# Altium schematic sheet Driver.SchDoc
size 297 x 209 mm; ENG_APP_DATE: --/--/--; DSN_APP_DATE: --/--/--; CHK_APP_DATE: --/--/--; SheetNumber: 2; SheetTotal: 5
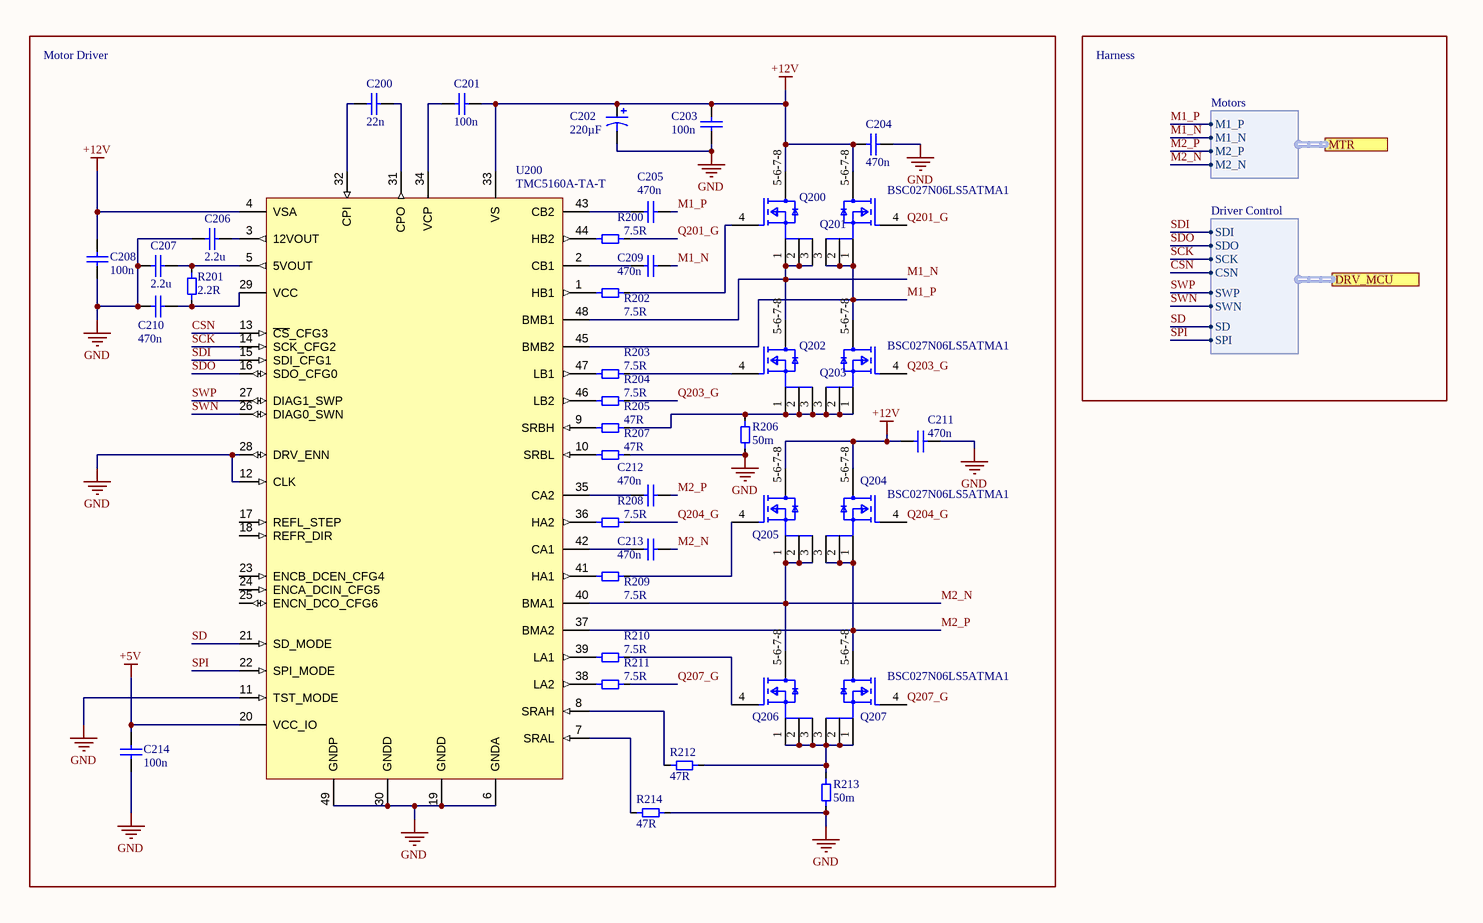
[diagram p0: Driver.SchDoc, right]

## Parts
C200  22n  [MLCC_0603_M]
C201  100n  [MLCC_0603_M]
C202  value 220µF  [8mm Cap]  (hidden comment: EEU-FS1H221L)
C203  100n  [MLCC_0603_M]
C204  470n  [MLCC_0805_M]
C205  470n  [MLCC_0805_M]
C206  2.2u  [MLCC_0805_M]
C207  2.2u  [MLCC_0805_M]
C208  100n  [MLCC_0603_M]
C209  470n  [MLCC_0805_M]
C210  470n  [MLCC_0805_M]
C211  470n  [MLCC_0805_M]
C212  470n  [MLCC_0805_M]
C213  470n  [MLCC_0805_M]
C214  100n  [MLCC_0603_M]
Q200  BSC027N06LS5ATMA1  [FP-PG-TDSON-8-MFG]  (value not drawn)
Q201  BSC027N06LS5ATMA1  [FP-PG-TDSON-8-MFG]
Q202  BSC027N06LS5ATMA1  [FP-PG-TDSON-8-MFG]  (value not drawn)
Q203  BSC027N06LS5ATMA1  [FP-PG-TDSON-8-MFG]
Q204  BSC027N06LS5ATMA1  [FP-PG-TDSON-8-MFG]
Q205  BSC027N06LS5ATMA1  [FP-PG-TDSON-8-MFG]  (value not drawn)
Q206  BSC027N06LS5ATMA1  [FP-PG-TDSON-8-MFG]  (value not drawn)
Q207  BSC027N06LS5ATMA1  [FP-PG-TDSON-8-MFG]
R200  7.5R  [Resistor_0603_M]
R201  2.2R  [Resistor_0603_M]
R202  7.5R  [Resistor_0603_M]
R203  7.5R  [Resistor_0603_M]
R204  7.5R  [Resistor_0603_M]
R205  47R  [Resistor_0603_M]
R206  value 50m  [PE0612FKM7W0R05L-Footprint-1]  (hidden comment: PE0612FKM7W0R05L)
R207  47R  [Resistor_0603_M]
R208  7.5R  [Resistor_0603_M]
R209  7.5R  [Resistor_0603_M]
R210  7.5R  [Resistor_0603_M]
R211  7.5R  [Resistor_0603_M]
R212  47R  [Resistor_0603_M]
R213  value 50m  [PE0612FKM7W0R05L-Footprint-1]  (hidden comment: PE0612FKM7W0R05L)
R214  47R  [Resistor_0603_M]
U200  TMC5160A-TA-T  [TQFP80P900X900X120-32N]

## Blocks framed on the sheet
Motor Driver: C200-C214 Q200-Q207 R200-R214 U200

## Ports
DRV_MCU (harness Driver Control, see Overview[3B], MCU_USB[2A]), MTR (harness Motors, see Overview[3B], Headers[2A])

## Harnesses
Motors: M1_P, M1_N, M2_P, M2_N
Driver Control: SCK, SWP, SWN, SDO, SD, SDI, SPI, CSN

## Nets
+5V: C214.2 U200.20(VCC_IO)
+12V: C201.1 C202.2 C203.2 C204.2 C208.2 C211.1 Q200.5-6-7-8(D) Q201.5-6-7-8(D) Q204.5-6-7-8(D) Q205.5-6-7-8(D) U200.4(VSA) U200.33(VS)
GND: C202.1 C203.1 C204.1 C206.1 C207.1 C208.1 C210.1 C211.2 C214.1 R206.1 R207.1 R213.1 R214.1 U200.6(GNDA) U200.11(TST_MODE) U200.12(CLK) U200.19(GNDD) U200.28(DRV_ENN) U200.30(GNDD) U200.49(GNDP)
CSN: U200.13(~{CS}_CFG3) ; port DRV_MCU.CSN
M1_N: C209.2 Q200.1(S) Q200.2(S) Q200.3(S) Q202.5-6-7-8(D) U200.48(BMB1) ; port MTR.M1_N
M1_P: C205.2 Q201.1(S) Q201.2(S) Q201.3(S) Q203.5-6-7-8(D) U200.45(BMB2) ; port MTR.M1_P
M2_N: C213.2 Q205.1(S) Q205.2(S) Q205.3(S) Q206.5-6-7-8(D) U200.40(BMA1) ; port MTR.M2_N
M2_P: C212.2 Q204.1(S) Q204.2(S) Q204.3(S) Q207.5-6-7-8(D) U200.37(BMA2) ; port MTR.M2_P
Q201_G: Q201.4(G) R200.2
Q203_G: Q203.4(G) R204.2
Q204_G: Q204.4(G) R208.2
Q207_G: Q207.4(G) R211.2
SCK: U200.14(SCK_CFG2) ; port DRV_MCU.SCK
SD: U200.21(SD_MODE) ; port DRV_MCU.SD
SDI: U200.15(SDI_CFG1) ; port DRV_MCU.SDI
SDO: U200.16(SDO_CFG0) ; port DRV_MCU.SDO
SPI: U200.22(SPI_MODE) ; port DRV_MCU.SPI
SWN: U200.26(DIAG0_SWN) ; port DRV_MCU.SWN
SWP: U200.27(DIAG1_SWP) ; port DRV_MCU.SWP
NetC200_1: C200.1 U200.32(CPI)
NetC200_2: C200.2 U200.31(CPO)
NetC201_2: C201.2 U200.34(VCP)
NetC205_1: C205.1 U200.43(CB2)
NetC206_2: C206.2 U200.3(12VOUT)
NetC207_2: C207.2 R201.2 U200.5(5VOUT)
NetC209_1: C209.1 U200.2(CB1)
NetC210_2: C210.2 R201.1 U200.29(VCC)
NetC212_1: C212.1 U200.35(CA2)
NetC213_1: C213.1 U200.42(CA1)
NetQ200_4: Q200.4(G) R202.2
NetQ202_1: Q202.1(S) Q202.2(S) Q202.3(S) Q203.1(S) Q203.2(S) Q203.3(S) R205.1 R206.2
NetQ202_4: Q202.4(G) R203.2
NetQ205_4: Q205.4(G) R209.2
NetQ206_1: Q206.1(S) Q206.2(S) Q206.3(S) Q207.1(S) Q207.2(S) Q207.3(S) R212.1 R213.2
NetQ206_4: Q206.4(G) R210.2
NetR200_1: R200.1 U200.44(HB2)
NetR202_1: R202.1 U200.1(HB1)
NetR203_1: R203.1 U200.47(LB1)
NetR204_1: R204.1 U200.46(LB2)
NetR205_2: R205.2 U200.9(SRBH)
NetR207_2: R207.2 U200.10(SRBL)
NetR208_1: R208.1 U200.36(HA2)
NetR209_1: R209.1 U200.41(HA1)
NetR210_1: R210.1 U200.39(LA1)
NetR211_1: R211.1 U200.38(LA2)
NetR212_2: R212.2 U200.8(SRAH)
NetR214_2: R214.2 U200.7(SRAL)

Not connected (* = marked no-connect by the designer): U200 17(REFL_STEP) 18(REFR_DIR) 23(ENCB_DCEN_CFG4) 24(ENCA_DCIN_CFG5) 25(ENCN_DCO_CFG6)

## Notes on the sheet
- Harness
- THIS DOCUMENT AND THE DATA DISCLOSED HEREIN OR
- HEREWITH IS THE PROPERTY OF ALTIUM LIMITED AND MAY
- DWG NO:
- REVISION
- REV:
- DESCRIPTION
- DATE
- APPROVED
- BE FREELY DISTRIBUTED IN WHOLE. NO RIGHTS ARE
- RESERVED OR EXPRESS OR IMPLIED WARANTEE GIVEN.
- ENG:
- APPROVALS
- PROJECT
- DSN:
- CHK:
- REFERENCE DOCUMENTS
- PROJECT REVISION:
- TITLE
- DOCUMENT REVISION:
- DESIGN ITEM:
- BOM:
- FAB DWG:
- PCB DWG:
- ASSY DWG:
- SCALE:
- A3
- SIZE
- CAGE CODE
- FILE NAME
- DWG NO.
- SHEET
- OF
- REV

## Library data of the parts
C200 = CMP-001-0577-1: MLCC, 0603, 22n, 10%, 6.3V, X7R; Manufacturer: Any; Value: 22nF; Capacitor Type: Ceramic; Voltage: 6,3V; Mount: SMD; RoHS: Yes; Tolerance: 10%; Dielectric: X7R; Case/Package: 0603; Part number: MLCC, 0603, 22n, 10%, 6.3V, X7R
C201 C203 C208 C214 = CMP-001-0755-1: MLCC, 0603, 100n, 10%, 35V, X7R; Manufacturer: Any; Capacitor Type: Ceramic; Value: 100nF; Voltage: 35V; Case/Package: 0603; Part number: MLCC, 0603, 100n, 10%, 35V, X7R; RoHS: Yes; Tolerance: 10%; Dielectric: X7R; Mount: SMD
C202 = CMP-002-0010-1: Panasonic EEUFS1H221L - Aluminum Electrolytic Capacitors (Radial Lead Type); Manufacturer: Any; Manufacturer Lifecycle Status: ACTIVE; Part Series: FS-A; Dielectric: X5R; Voltage: 50V; Capacitor Type: Ceramic; Leakage Current: 110µA; Tolerance: 20%; Life (Hours): 9000hours; Capacitance: 10uF; ESR (Equivalent Series Resistance): 33mΩ; Ripple Current: 1.43A; Height: 22mm; Height - Seated (Max): 0.315inch; Length: 20mm; Case/Package: Radial; RoHS: Compliant; Construction: Cylindrical; Pins: 2; Mount: THT; Features: General Purpose; Part number: EEU-FS1H221L; Diameter: 8mm; Lifecycle Status: Production; Max Operating Temperature: 105°C; Min Operating Temperature: -40°C; Number of Terminals: 2; Packaging: Bulk; REACH SVHC: Yes; Schedule B: 8532220020; Terminal Pitch: 3.5mm; Voltage Rating: 50V; Voltage Rating (DC): 50V
C204 C205 C209-C213 = CMP-001-0836-2: MLCC, 0805, 470n, 10%, 6.3V, X7R; Manufacturer: Any; Capacitor Type: Ceramic; Value: 470nF; Voltage: 6,3V; Case/Package: 0805; Part number: MLCC, 0805, 470n, 10%, 6.3V, X7R; Mount: SMD; RoHS: Yes; Dielectric: X7R; Tolerance: 10%
C206 C207 = CMP-001-0842-2: MLCC, 0805, 2.2u, 10%, 6.3V, X7R; Manufacturer: Any; Value: 2,2µF; Voltage: 6,3V; Capacitor Type: Ceramic; Dielectric: X7R; RoHS: Yes; Tolerance: 10%; Part number: MLCC, 0805, 2.2u, 10%, 6.3V, X7R; Mount: SMD; Case/Package: 0805
Q200-Q207 = CMP-ROOT-01287-1: Power MOSFET, N Channel, 60 V, 100 A, 0.0027 ohm, TDSON, Surface Mount; Manufacturer: Infineon Technologies; Continuous Drain Current (ID): 23A; Drain to Source Breakdown Voltage: 60V; Drain to Source Resistance: 2.7mΩ; Gate to Source Voltage (Vgs): 20V; Max Junction Temperature (Tj): 150°C; Max Power Dissipation: 83W; Number of Channels: 1; Power Dissipation: 2.5W; Turn-Off Delay Time: 25ns; Turn-On Delay Time: 7.7ns; Case/Package: PG-TDSON-8-7; Mount: SMD; Part number: BSC027N06LS5ATMA1; RoHS: Compliant; China RoHS: Non-Compliant; Drain to Source Voltage (Vdss): 60V; Height: 1mm; Lifecycle Status: Production; Max Operating Temperature: 150°C; Min Breakdown Voltage: 60V; Min Operating Temperature: -55°C; Number of Elements: 1; Number of Terminals: 8; On-State Resistance: 2.7mΩ; Package Quantity: 5000; Packaging: Tape & Reel; REACH SVHC: No; Schedule B: 8541290080, 8541290080
R200 R202-R204 R208-R211 = CMP-001-0026-2: Resistor, 0603, 7.5R, 1%, 1/10W; Manufacturer: Any; Power: 100mW; Value: 7,5; Tolerance: 1%; Mount: SMD; Case/Package: 0603; Part number: Resistor, 0603, 7.5R, 1%, 1/10W; RoHS: Yes
R201 = CMP-001-0012-2: Resistor, 0603, 2.2R, 1%, 1/10W; Manufacturer: Any; Power: 100mW; Value: 2,2; Mount: SMD; RoHS: Yes; Tolerance: 1%; Part number: Resistor, 0603, 2.2R, 1%, 1/10W; Case/Package: 0603
R205 R207 R212 R214 = CMP-001-0046-3: Resistor, 0603, 47R, 1%, 1/10W; Manufacturer: Any; Value: 47; Power: 100mW; RoHS: Yes; Tolerance: 1%; Case/Package: 0603; Part number: Resistor, 0603, 47R, 1%, 1/10W; Mount: SMD
R206 R213 = CMP-001-1896-1: Current Sensor-Low TCR Chip Resistor Wide Terminal Metal Alloy 0612 50mOhm 1% Emboss T/R; Manufacturer: Any; Power: 2W; Temperature Coefficient: 75ppm/°C; Case/Package: 0612; Mount: SMD; Part number: PE0612FKM7W0R05L; Pins: 2; RoHS: Compliant; Tolerance: 1%; Lifecycle Status: Production; Number of Terminals: 2; REACH SVHC: Yes
U200 = CMP-ROOT-00744-3: IC Mtr Drvr Bipolar 8-60V 48TQFP; Manufacturer: Trinamic Motion Control GmbH; Logic Function: AND GATE; Output Current: 20A; Interface: SPI; RoHS: Yes; Packaging: Tape and Reel; Case/Package: 48-TQFP Exposed Pad; Max Operating Temperature: 125°C; Min Operating Temperature: -40°C; Mount: Surface Mount; Part number: TMC5160A-TA-T